# EAGLE design ARP Odyssey Ring Mod 1.1 (EAGLE 7.7.0)
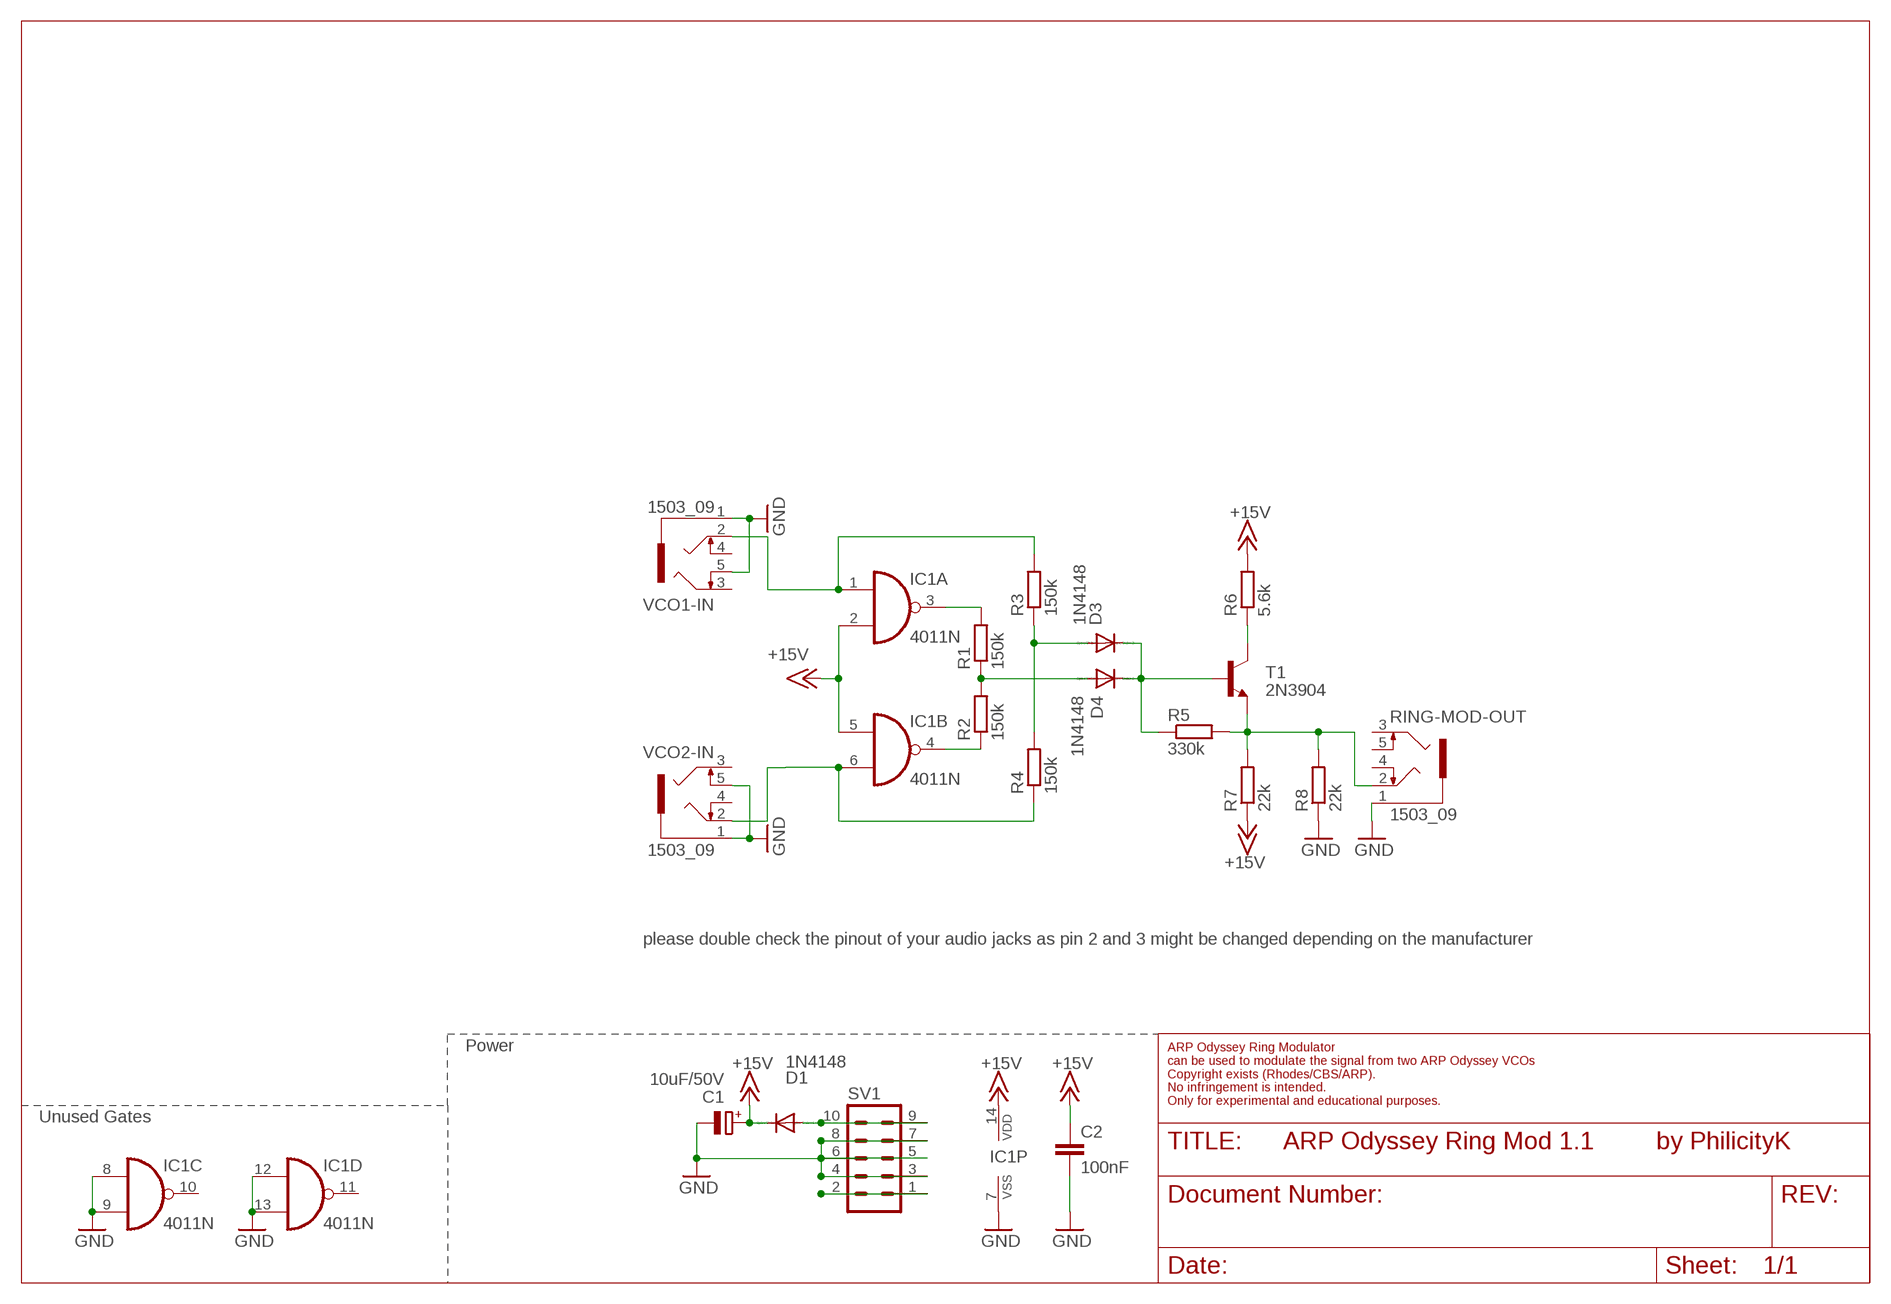
[diagram p0: schematic, sheet 1]

## Parts
C1  10uF/50V  CPOL-EUE3.5-8  [E3,5-8]
C2  100nF  C-EU050-024X044  [C050-024X044]
D1  1N4148  1N4148DO35-7  [DO35-7]
D3  1N4148  1N4148DO35-7  [DO35-7]
D4  1N4148  1N4148DO35-7  [DO35-7]
IC1  4011N  [DIL14]
R1  150k  R-EU_0207/7  [0207/7]
R2  150k  R-EU_0207/7  [0207/7]
R3  150k  R-EU_0207/7  [0207/7]
R4  150k  R-EU_0207/7  [0207/7]
R5  330k  R-EU_0207/7  [0207/7]
R6  5.6k  R-EU_0207/7  [0207/7]
R7  22k  R-EU_0207/7  [0207/7]
R8  22k  R-EU_0207/7  [0207/7]
RING-MOD-OUT  1503_09  [1503_09]
SV1  ML10  [ML10]
T1  2N3904  2N3904-NPN-TO92-EBC  [TO92-EBC]
VCO1-IN  1503_09  [1503_09]
VCO2-IN  1503_09  [1503_09]

## Nets
+15V: C1.+ C2.1 D1.C IC1.2(A:I1) IC1.5(B:I0) IC1.14(P:VDD) R6.2 R7.1
GND: C1.- C2.2 IC1.7(P:VSS) IC1.8(C:I0) IC1.9(C:I1) IC1.12(D:I0) IC1.13(D:I1) R8.1 RING-MOD-OUT.1 SV1.3 SV1.4 SV1.5 SV1.6 SV1.7 SV1.8 VCO1-IN.1 VCO1-IN.5 VCO2-IN.1 VCO2-IN.5
N$1: D1.A SV1.9 SV1.10
N$2: IC1.3(A:O) R1.2
N$3: IC1.4(B:O) R2.1
N$4: D4.A R1.1 R2.2
N$5: SV1.1 SV1.2
N$6: R5.2 R7.2 R8.2 RING-MOD-OUT.2 T1.E
N$7: IC1.6(B:I1) R4.1 VCO2-IN.2
N$8: IC1.1(A:I0) R3.2 VCO1-IN.2
N$9: D3.A R3.1 R4.2
N$10: D3.C D4.C R5.1 T1.B
N$11: R6.1 T1.C
Unconnected: IC1.10(C:O) IC1.11(D:O) RING-MOD-OUT.3 RING-MOD-OUT.4 RING-MOD-OUT.5 VCO1-IN.3 VCO1-IN.4 VCO2-IN.3 VCO2-IN.4

## Notes on the sheet
- please double check the pinout of your audio jacks as pin 2 and 3 might be changed depending on the manufacturer
- Power
- ARP Odyssey Ring Modulator
  can be used to modulate the signal from two ARP Odyssey VCOs
  Copyright exists (Rhodes/CBS/ARP).
  No infringement is intended.
  Only for experimental and educational purposes.
- Unused Gates
- by PhilicityK

## Library data of the parts
C1 = rcl:CPOL-EU: POLARIZED CAPACITOR, European symbol
C2 = rcl:C-EU: CAPACITOR, European symbol
D1 D3 D4 = diode:1N4148: DIODE high speed (Philips)
IC1 = 40xx:4011: Quad 2-input NAND
R1-R8 = rcl:R-EU_: RESISTOR, European symbol
RING-MOD-OUT VCO1-IN VCO2-IN = con-lumberg:1503_09: Jack connectors according to JISC 6560, 3.5 mm Klinkeneinbaukupplung nach JISC 6560, 3,5 mm, 3-polig/ stereo, abgewinkelte Ausführung, mit 2 Öffnern und Lötaugen, für Leiterplatten Rückseitenmontage Source: http://www.lumberg.com/Produkte/PDFs/1503_09.pdf; OC_FARNELL: 1243244; OC_NEWARK: unknown
SV1 = con-harting-ml:ML10: HARTING; OC_FARNELL: unknown; OC_NEWARK: unknown
T1 = transistor-neu-to92:*-NPN-: NPN Transistror

## Board
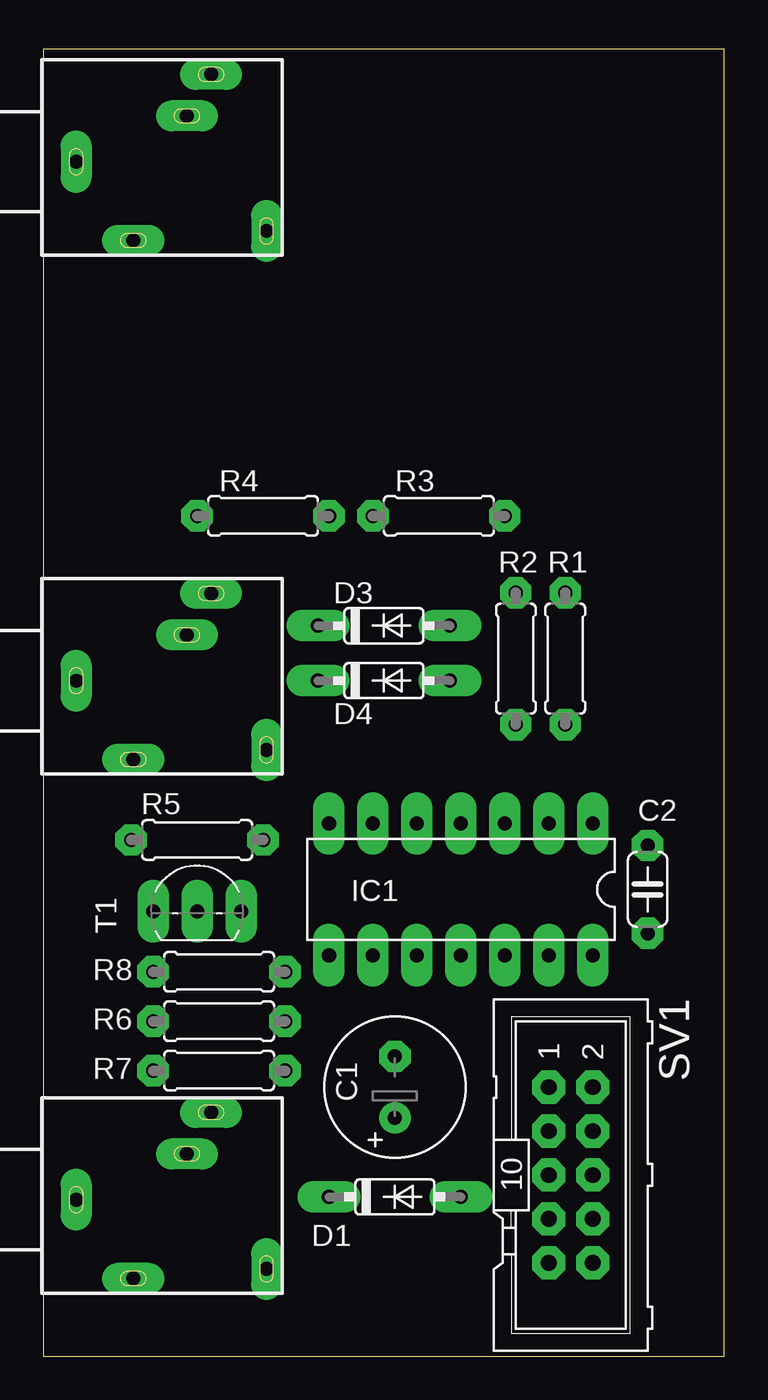
[diagram p1: board, top side]
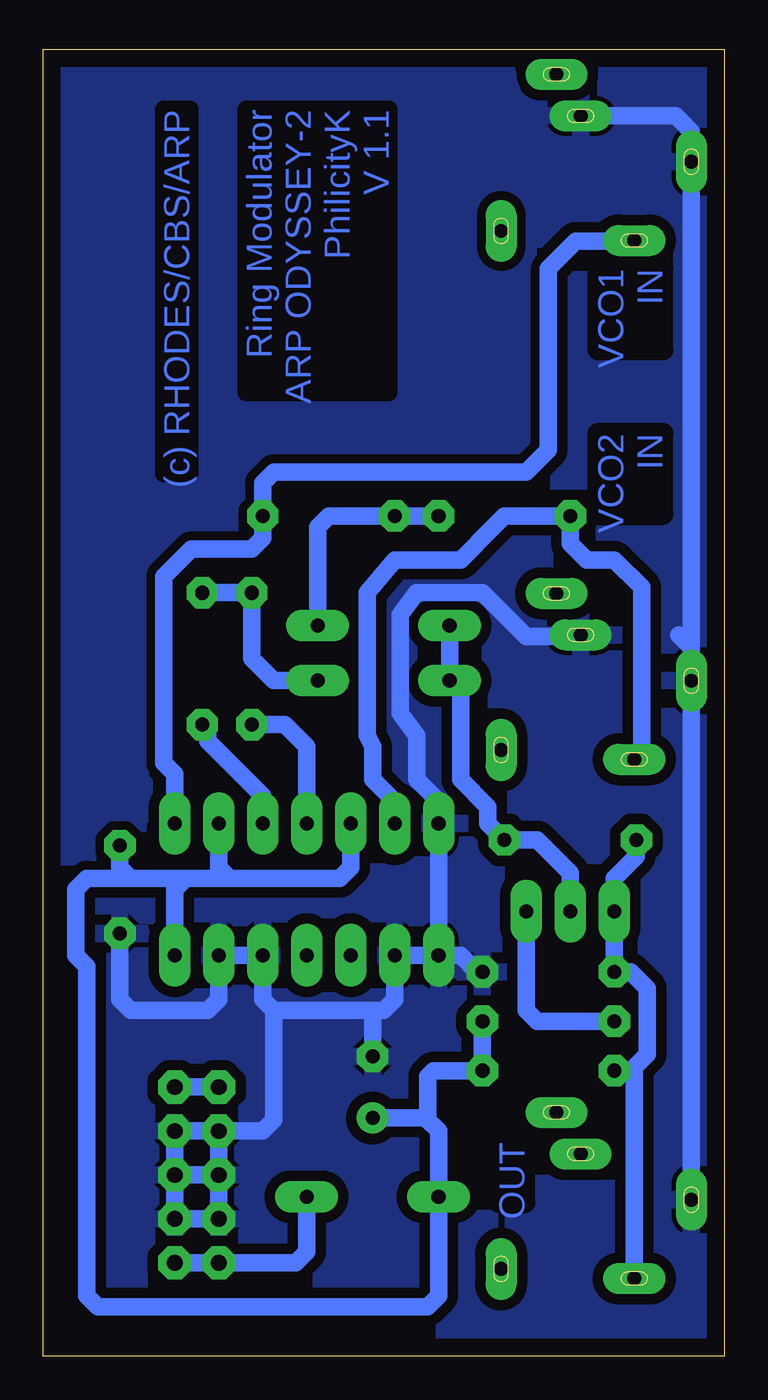
[diagram p2: board, bottom side, seen from below]

Size 39.35 x 75.56 mm. Coordinates in mm from the lower left corner, seen from the top.
Outline: 0,0 39.35,0 39.35,75.56 0,75.56 0,0
Copper layers (1*16): Top 0.035mm / dielectric 1.5mm / Bottom 0.035mm
Design rules "default *": minimum track width 10mil, minimum drill 24mil, track to track 0.4mm, track to pad 0.4mm, pad to pad 0.4mm, via to via 0.4mm, smd to smd 8mil, copper to edge 40mil, drill to drill 8mil, minimum pad ring 0.5mm, minimum via ring 0.5mm, stop-mask expansion 4mil, vias tented up to drill 0mil, thermal gap 10mil

### Footprints (pad centres in the part's own frame; a part is rotated, then mirrored left to right if it is on the bottom)
E3,5-8 = drill 0.813 pad 1.6: + -1.778,0 | drill 0.813 pad 1.6 octagon: - 1.778,0
C050-024X044 = drill 0.813 octagon: 1 -2.54,0; 2 2.54,0
DO35-7 = drill 0.813 long: A 3.81,0; C -3.81,0
DIL14 = drill 0.813 long: 1 -7.62,-3.81; 2 -5.08,-3.81; 3 -2.54,-3.81; 4 0,-3.81; 5 2.54,-3.81; 6 5.08,-3.81; 7 7.62,-3.81; 8 7.62,3.81; 9 5.08,3.81; 10 2.54,3.81; 11 0,3.81; 12 -2.54,3.81; 13 -5.08,3.81; 14 -7.62,3.81
0207/7 = drill 0.813 octagon: 1 -3.81,0; 2 3.81,0
1503_09 = drill 0.8 pad 1.2 long: 1 0,-2.1; 2 -4.55,-5.4; 3 5.05,-9.9; 4 -4,-13.1; 5 2.65,-8.5
ML10 = drill 0.914 octagon: 1 -5.08,-1.27; 2 -5.08,1.27; 3 -2.54,-1.27; 4 -2.54,1.27; 5 0,-1.27; 6 0,1.27; 7 2.54,-1.27; 8 2.54,1.27; 9 5.08,-1.27; 10 5.08,1.27
TO92-EBC = drill 0.813 long: B 0,-1.27; C 2.54,-1.27; E -2.54,-1.27

### Placement (x,y rotation side)
C1  20.32,15.56 90 top
C2  34.92,26.99 270 top
D1  20.32,9.21 0 top
D3  19.68,42.23 0 top
D4  19.68,39.05 0 top
IC1  24.13,26.99 180 top
R1  30.16,40.32 270 top
R2  27.3,40.32 90 top
R3  22.86,48.58 0 top
R4  12.7,48.58 0 top
R5  8.89,29.84 180 top
R6  10.16,19.37 0 top
R7  10.16,16.51 180 top
R8  10.16,22.23 180 top
RING-MOD-OUT  -0.2,9.05 90 top
SV1  30.48,10.48 270 top
T1  8.89,26.99 0 top
VCO1-IN  -0.2,69.05 90 top
VCO2-IN  -0.2,39.05 90 top

### Tracks (layer width: path | path; a pad name or v marks a point on that pad's centre or on a via)
+15V
  Bottom 1.016: C1.+ 17.27,13.78 | 17.27,13.78 16.51,13.02 D1.C 16.51,3.49 17.14,2.86 36.2,2.86 36.83,3.49 36.83,22.54 37.47,23.18 37.47,26.99 36.83,27.62 34.29,27.62 | IC1.5 21.59,28.26 22.23,27.62 28.57,27.62 | 28.57,27.62 29.21,28.26 IC1.2 | 28.57,27.62 31.11,27.62 | 31.11,27.62 31.75,26.99 IC1.14 | 31.11,27.62 34.29,27.62 | 34.29,27.62 34.92,28.26 C2.1 | R6.2 R7.1 16.83,16.51 17.14,16.19 17.14,13.91 17.27,13.78
GND
  Bottom 1.016: 1.9,40.96 VCO1-IN.1 1.9,70.8 2.54,71.44 2.8,71.7 VCO1-IN.5 | 1.9,40.96 VCO2-IN.1 RING-MOD-OUT.1 | 2.64,41.7 1.9,40.96 | IC1.8 IC1.9 19.05,20.64 19.68,20 20.32,20 | IC1.8 IC1.7 16.51,32.07 17.78,33.34 17.78,35.88 18.73,37.15 18.73,39.69 18.73,42.86 17.78,44.13 13.97,44.13 12.7,42.86 12.06,42.23 11.43,41.59 8.4,41.59 VCO2-IN.5 | SV1.5 SV1.6 | SV1.6 SV1.4 SV1.3 | SV1.6 SV1.8 SV1.7 SV1.5 | SV1.5 SV1.3 | C2.2 34.92,20.64 34.29,20 29.84,20 29.21,20.64 IC1.13 IC1.12 26.67,20.64 26.04,20 | 26.04,20 20.32,20 | C1.- 20.32,20 | IC1.8 15.24,23.18 14.29,22.23 R8.1 | SV1.3 26.67,13.02 26.04,13.65 26.04,20
  pour Bottom (isolate 0.61): 0,74.93 39.69,74.93 39.37,0 -0.32,0
N$1
  Bottom 1.016: SV1.10 SV1.9 24.77,5.4 24.13,6.03 D1.A
N$2
  Bottom 1.016: IC1.3 26.67,32.38 29.53,35.24 29.84,35.56 29.84,36.2 R1.2
N$3
  Bottom 1.016: IC1.4 24.13,35.24 25.4,36.51 R2.1
N$4
  Bottom 1.016: D4.A 26.04,39.05 27.3,40.32 R2.2 R1.1
N$5
  Bottom 1.016: SV1.2 SV1.1
N$6
  Bottom 1.016: R7.2 5.4,16.51 | 5.4,16.51 4.45,17.46 4.45,21.27 5.4,22.23 R8.2 T1.E 6.35,27.62 5.08,28.89 R5.2 | 5.4,16.51 5.2,16.51 RING-MOD-OUT.2
N$7
  Bottom 1.016: IC1.6 19.05,32.07 19.68,32.7 20.32,33.34 20.32,35.24 20.64,35.88 20.64,44.13 19.05,46.04 15.24,46.04 13.34,47.94 12.7,48.58 R4.1 8.89,46.99 7.94,46.04 6.35,46.04 4.76,44.45 4.76,39.37 4.76,34.5 VCO2-IN.2
N$8
  Bottom 1.016: IC1.1 31.75,33.66 32.38,34.29 32.38,45.09 30.8,46.67 30.48,46.67 27.3,46.67 26.67,47.31 R3.2 26.67,50.48 26.04,51.12 11.43,51.12 10.16,52.39 10.16,62.87 8.57,64.45 5.25,64.45 VCO1-IN.2
N$9
  Bottom 1.016: R3.1 R4.2 22.86,48.58 23.5,47.94 D3.A
N$10
  Bottom 1.016: D3.C D4.C 15.24,38.42 15.24,33.34 13.65,31.75 13.65,30.8 R5.1 10.79,29.84 8.89,27.94 T1.B
N$11
  Bottom 1.016: R6.1 10.79,19.37 11.43,20 T1.C
N$12
  pour Bottom (isolate 0.5): 12.38,74.93 39.37,74.93 39.37,28.57 33.66,28.57 32.7,46.35 28.57,47.31 28.26,47.62 28.26,48.26 27.3,51.44 10.79,52.07 11.11,69.85

### Text on the board
Bottom: Ring Modulator / ARP ODYSSEY-2 / PhilicityK / V 1.1 | (c) RHODES/CBS/ARP | VCO1 / IN | VCO2 / IN | OUT